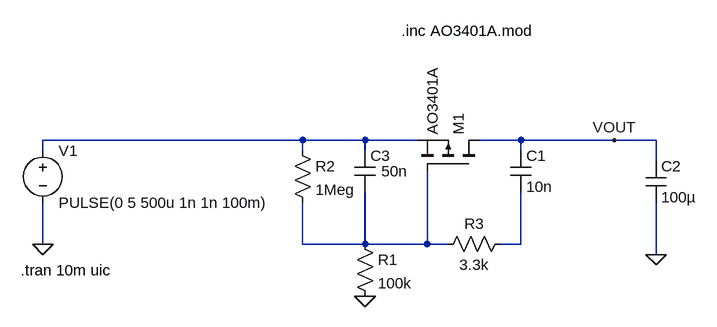
[diagram p0: schematic inrush_current_limit.asc]
inrush_current_limit.asc, the LTspice schematic file:
Version 4
SHEET 1 880 680
WIRE -48 16 -448 16
WIRE 48 16 -48 16
WIRE 128 16 48 16
WIRE 288 16 224 16
WIRE 432 16 288 16
WIRE 496 16 432 16
WIRE -448 32 -448 16
WIRE -48 32 -48 16
WIRE 48 32 48 16
WIRE 288 32 288 16
WIRE 496 48 496 16
WIRE -448 176 -448 112
WIRE -48 176 -48 112
WIRE 48 176 48 96
WIRE 48 176 -48 176
WIRE 144 176 144 64
WIRE 144 176 48 176
WIRE 176 176 144 176
WIRE 288 176 288 96
WIRE 288 176 256 176
WIRE 496 192 496 112
FLAG -448 176 0
FLAG 496 192 0
FLAG 432 16 VOUT
FLAG 48 256 0
SYMBOL res 32 160 R0
SYMATTR InstName R1
SYMATTR Value 100k
SYMBOL cap 272 32 R0
SYMATTR InstName C1
SYMATTR Value 10n
SYMBOL pmos 224 64 M270
SYMATTR InstName M1
SYMATTR Value AO3401A
SYMATTR Prefix X
SYMBOL voltage -448 16 R0
WINDOW 123 0 0 Left 0
WINDOW 39 0 0 Left 0
SYMATTR InstName V1
SYMATTR Value PULSE(0 5 500u 1n 1n 100m)
SYMBOL cap 480 48 R0
SYMATTR InstName C2
SYMATTR Value 100µ
SYMBOL res 272 160 R90
WINDOW 0 0 56 VBottom 2
WINDOW 3 32 56 VTop 2
SYMATTR InstName R3
SYMATTR Value 3.3k
SYMBOL cap 32 32 R0
WINDOW 3 41 32 Left 2
SYMATTR InstName C3
SYMATTR Value 50n
SYMBOL res -64 16 R0
SYMATTR InstName R2
SYMATTR Value 1Meg
TEXT 104 -152 Left 2 !.inc AO3401A.mod
TEXT -482 216 Left 2 !.tran 10m uic

The netlist it stands for:
* inrush_current_limit.asc
R1 N002 0 100k
C1 VOUT N003 10n
XM1 VOUT N002 N001 AO3401A  ; pins D G S
V1 N001 0 PULSE(0 5 500u 1n 1n 100m)
C2 VOUT 0 100µ
R3 N003 N002 3.3k
C3 N001 N002 50n
R2 N001 N002 1Meg
.inc AO3401A.mod
.tran 10m uic
.backanno
.end